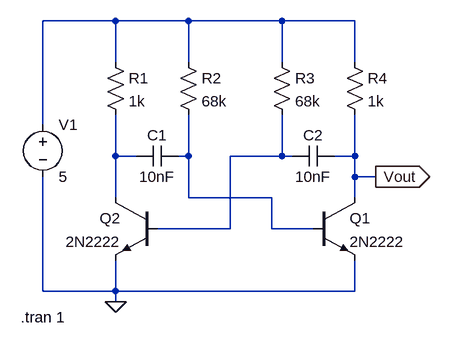
[diagram p0: schematic Q4.asc]
Q4.asc, the LTspice schematic file:
Version 4
SHEET 1 880 680
WIRE 208 -32 96 -32
WIRE 320 -32 208 -32
WIRE 464 -32 320 -32
WIRE 576 -32 464 -32
WIRE 208 32 208 -32
WIRE 320 32 320 -32
WIRE 464 32 464 -32
WIRE 576 32 576 -32
WIRE 96 128 96 -32
WIRE 208 176 208 112
WIRE 240 176 208 176
WIRE 320 176 320 112
WIRE 320 176 304 176
WIRE 464 176 464 112
WIRE 464 176 384 176
WIRE 480 176 464 176
WIRE 576 176 576 112
WIRE 576 176 544 176
WIRE 576 208 576 176
WIRE 608 208 576 208
WIRE 208 240 208 176
WIRE 320 240 320 176
WIRE 448 240 320 240
WIRE 576 240 576 208
WIRE 384 288 384 176
WIRE 384 288 272 288
WIRE 448 288 448 240
WIRE 512 288 448 288
WIRE 96 384 96 208
WIRE 208 384 208 336
WIRE 208 384 96 384
WIRE 576 384 576 336
WIRE 576 384 208 384
WIRE 208 400 208 384
FLAG 208 400 0
FLAG 608 208 Vout
IOPIN 608 208 Out
SYMBOL voltage 96 112 R0
WINDOW 123 0 0 Left 0
WINDOW 39 0 0 Left 0
SYMATTR InstName V1
SYMATTR Value 5
SYMBOL res 192 16 R0
SYMATTR InstName R1
SYMATTR Value 1k
SYMBOL res 304 16 R0
SYMATTR InstName R2
SYMATTR Value 68k
SYMBOL res 448 16 R0
SYMATTR InstName R3
SYMATTR Value 68k
SYMBOL res 560 16 R0
SYMATTR InstName R4
SYMATTR Value 1k
SYMBOL cap 304 160 R90
WINDOW 0 0 32 VBottom 2
WINDOW 3 32 32 VTop 2
SYMATTR InstName C1
SYMATTR Value 10nF
SYMBOL cap 544 160 R90
WINDOW 0 0 32 VBottom 2
WINDOW 3 32 32 VTop 2
SYMATTR InstName C2
SYMATTR Value 10nF
SYMBOL npn 512 240 R0
SYMATTR InstName Q1
SYMATTR Value 2N2222
SYMBOL npn 272 240 M0
SYMATTR InstName Q2
SYMATTR Value 2N2222
TEXT 62 424 Left 2 !.tran 1

The netlist it stands for:
* Q4.asc
V1 N001 0 5
R1 N001 N002 1k
R2 N001 N003 68k
R3 N001 N004 68k
R4 N001 Vout 1k
C1 N003 N002 10nF
C2 Vout N004 10nF
Q1 Vout N003 0 0 2N2222
Q2 N002 N004 0 0 2N2222
.model NPN NPN
.model PNP PNP
.lib standard.bjt
.tran 1
.backanno
.end